# EasyEDA Pro project MP2236.eprj

# Schematic Schematic1
Create Date: 2023-08-06; Page Name: P1; Project Name: MP2236; Schematic Name: Schematic1; Update Date: 2023-08-06; Company: 嘉立创EDA; Page Size: A4; Version: V1.0
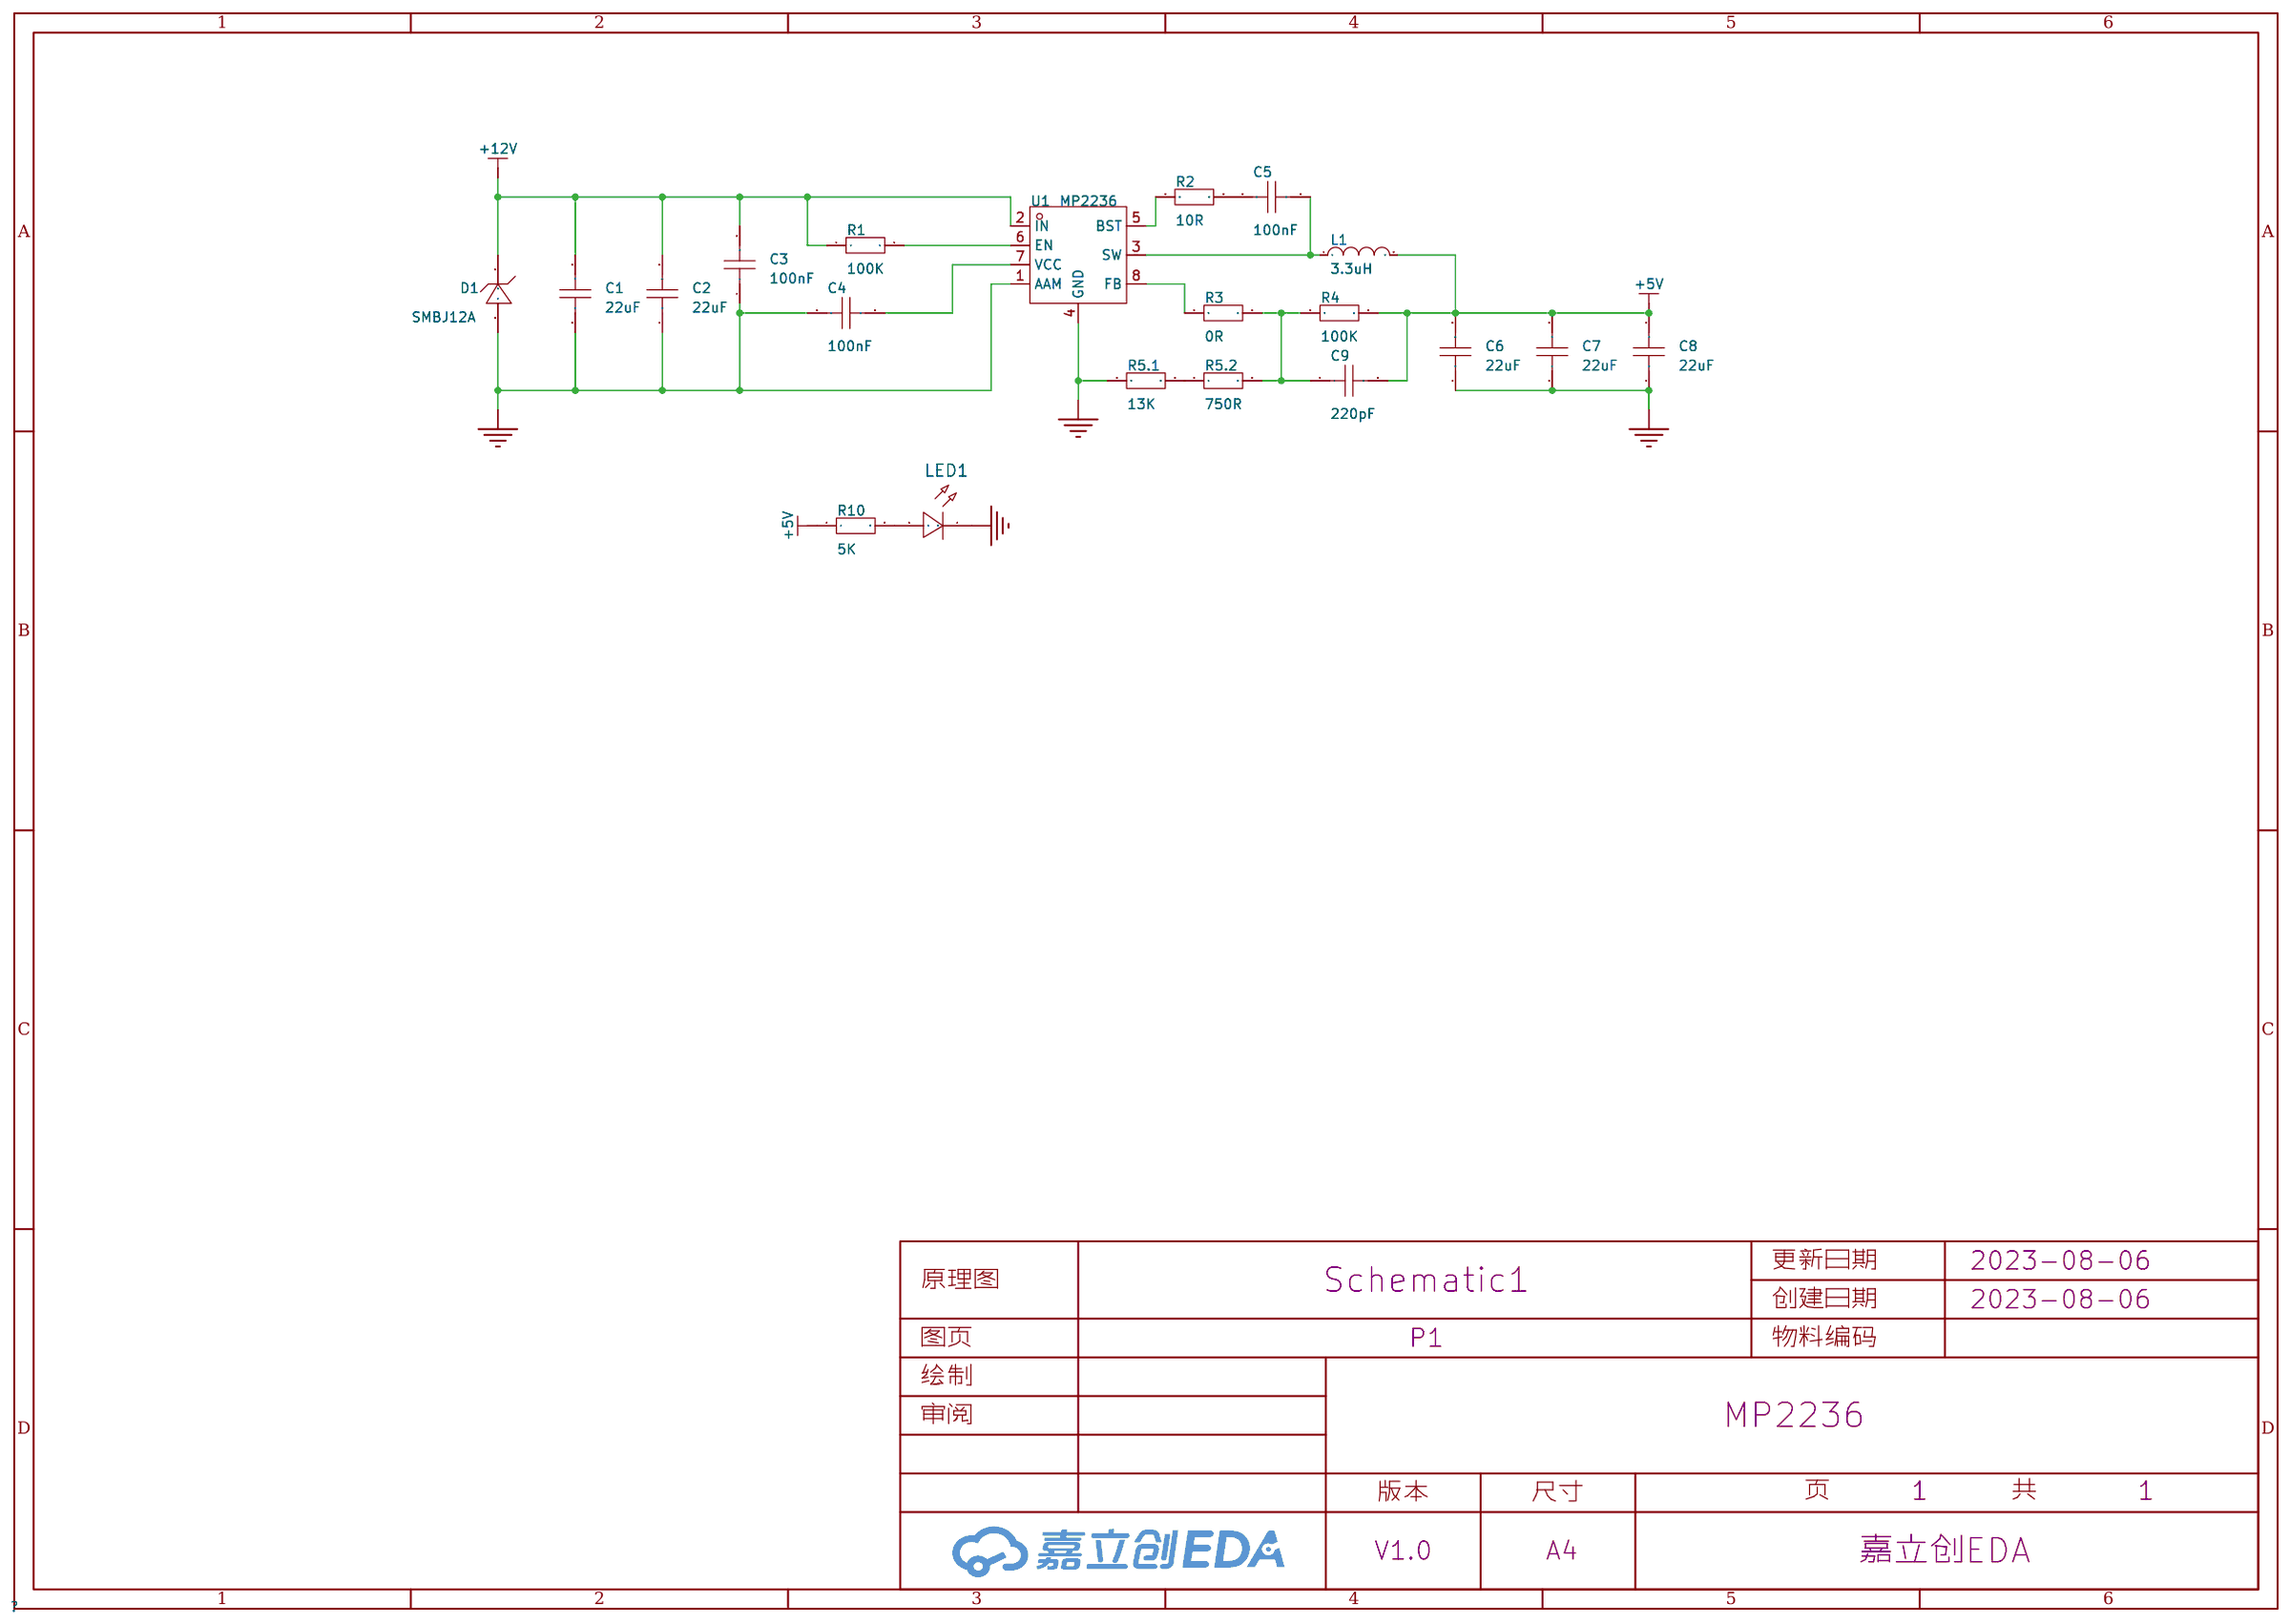
[diagram p0: schematic sheet]

## Parts
C1  22uF  [C1206]
C2  22uF  [C1206]
C3  100nF  [C0805]
C4  100nF  [C0603]
C5  100nF  [C0603]
C6  22uF  [C0805]
C7  22uF  [C0805]
C8  22uF  [C0805]
C9  220pF  [C0603]
D1  SMBJ12A  [SMB_L4.6-W3.6-LS5.3-RD]
L1  3.3uH  [IND-SMD_L7.3-W6.6]
LED1  -  [LED_0603]
R1  100K  [R0603]
R2  10R  [R0603]
R3  0R  [R0603]
R4  100K  [R0603]
R5.1  13K  [R0603]
R5.2  750R  [R0603]
R10  5K  [R0603]
U1  MP2236  [TSOT-23-8_L2.9-W1.6-P0.65-LS2.8-BL]

## Library data of the parts
C1 C2 = CAP_1206: Supplier Footprint: 1206
C3 C6-C8 = CAP_0805: Supplier Footprint: 0805
C4 C5 C9 = CAP_0603: Supplier Footprint: 0603
D1 = SMBJ12A_C127552: 极性:Unidirectional;峰值脉冲电流（10/1000us）:30.2A;箝位电压:19.9V;击穿电压（最小值）:13.3V;反向关断电压（典型值）:12V;; Supplier Part: C127552; Supplier Footprint: SMB(DO-214AA); JLCPCB Part Class: Extended Part; Datasheet: https://atta.szlcsc.com/upload/public/pdf/source/20170919/C127552_1505799641526977487.pdf; Supplier: LCSC
L1 = MCS0630-2R2MPY1: 电感值:2.2uH;精度:±20%;额定电流:8A;饱和电流(Isat):12A;; LCSC Part Name: 2.2uH ±20% 8A 17mΩ; Supplier Part: C2937096; Manufacturer: PSA(信昌电陶); Supplier Footprint: 0630; JLCPCB Part Class: Extended Part; Datasheet: https://atta.szlcsc.com/upload/public/pdf/source/20220121/EA6E6E6F70ED7BAE67EC293805EAAACB.pdf; Supplier: LCSC; Tolerance: ±20%; Rated Current: 8A; Saturation Current (Isat): 12A; DC Resistance (DCR): 17mΩ
LED1 = LED_0603-R: Supplier Footprint: 0603
R1-R4 R5.1 R5.2 R10 = Res_0603: Supplier Footprint: 0603
U1 = MP2315SGJ-Z: Supplier Part: C3031493; Supplier Footprint: TSOT23-8; JLCPCB Part Class: Extended Part; Datasheet: https://atta.szlcsc.comnull; Supplier: LCSC

## Nets
+5V: C6.2 C7.2 C8.2 C9.2 L1.2 R4.2 R10.1
+12V: C1.2 C2.2 C3.2 D1.1(C) R1.1 U1.2(IN)
GND: C1.1 C2.1 C3.1 C4.1 C6.1 C7.1 C8.1 D1.2(A) LED1.1(C) R5.1.1 U1.1(AAM) U1.4(GND)
$1N587: R1.2 U1.6(EN)
$1N589: C4.2 U1.7(VCC)
$1N604: R2.1 U1.5(BST)
$1N607: C5.2 L1.1 U1.3(SW)
$1N1046: R5.1.2 R5.2.1
$1N1855: R3.1 U1.8(FB)
$1N1858: C9.1 R3.2 R4.1 R5.2.2
$1N2066: C5.1 R2.2
$1N2285: LED1.2(A) R10.2

# Board PCB1
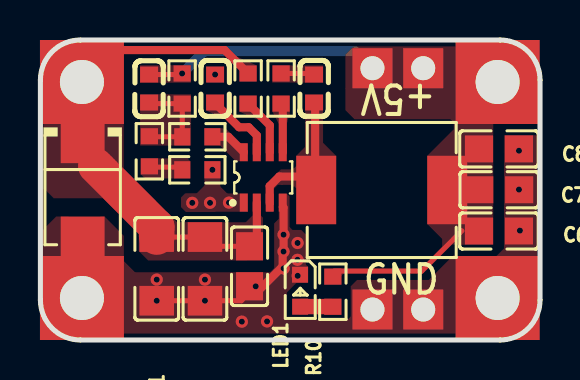
[diagram p1: board, top side]
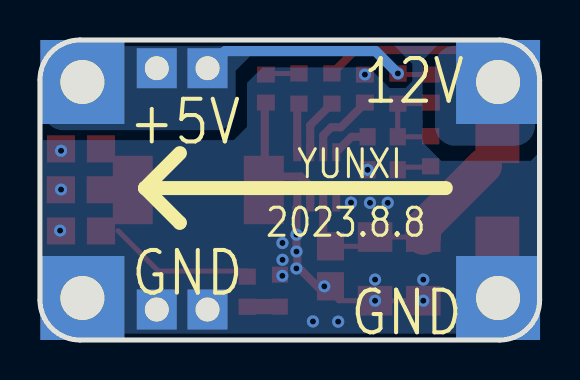
[diagram p2: board, bottom side, seen from below]

Outline 25 x 15 mm; copper layers: Top Layer, Bottom Layer. Coordinates in mm from the lower left corner of the outline.
Outline path: 0,13 0,2 arc(0.59,0.59) 2,0 23,0 arc(24.41,0.59) 25,2 25,13 arc(24.41,14.41) 23,15 2,15 arc(0.59,14.41) 0,13
Stack: Top Layer 0.035mm / Dielectric1 1.51mm FR4 er 4.5 / Bottom Layer 0.035mm

## Design rules (mm)
template: JLCPCB Capability(Two Layers Board)
spacing copperThickness1oz (default): track to track 0.102, other pairs 0.152 to 0.3
spacing copperThickness2oz: track to track 0.203, other pairs 0.152 to 0.3
track width copperThickness1oz (default): min 0.127, default 0.254, max 2.54
track width copperThickness2oz: min 0.203, default 0.254, max 2.54
differential pair differentialPair (default): width min 0.127, default 0.254, max 2.54; gap min 0.152, default 0.152
via viaSize (default): diameter min 0.5, default 0.61, max 10; hole min 0.3, default 0.305, max 6.3

## Placement (name value [footprint] x y rotation side)
C1  22uF  [C1206]  5.82 3.56 90 top
C2  22uF  [C1206]  8.23 3.56 90 top
C3  100nF  [C0805]  10.46 3.69 90 top
C4  100nF  [C0603]  8.74 12.57 270 top
C5  100nF  [C0603]  13.69 12.57 270 top
C6  22uF  [C0805]  22.95 5.45 180 top
C7  22uF  [C0805]  22.96 7.51 180 top
C8  22uF  [C0805]  22.95 9.55 180 top
C9  220pF  [C0603]  5.44 12.57 90 top
D1  SMBJ12A  [SMB_L4.6-W3.6-LS5.3-RD]  2.11 7.51 270 top
L1  3.3uH  [ind-smd_l7.3-w6.6]  17.08 7.5 180 top
LED1  -  [LED_0603]  13 2.42 270 top
NOREF  -  [Pad_e123]  16.62 13.59 0 top
NOREF#2  -  [Pad_e105]  2.08 12.9 0 top
NOREF#3  -  [Pad_e107]  22.88 2.1 0 top
NOREF#4  -  [Pad_e124]  19.16 13.59 0 top
NOREF#5  -  [Pad_e127]  19.16 1.52 0 top
NOREF#6  -  [Pad_e126]  16.62 1.52 0 top
NOREF#7  -  [Pad_e103]  2.08 2.1 0 top
NOREF#8  -  [Pad_e106]  22.88 12.9 0 top
R1  100K  [R0603]  10.39 12.57 270 top
R2  10R  [R0603]  12.04 12.57 90 top
R3  0R  [R0603]  7.85 10.16 180 top
R4  100K  [R0603]  7.09 12.57 90 top
R5.1  13K  [R0603]  7.85 8.51 180 top
R5.2  750R  [R0603]  5.45 9.44 90 top
R10  5K  [R0603]  14.63 2.42 270 top
U1  MP2236  [TSOT-23-8_L2.9-W1.6-P0.65-LS2.8-BL]  11.15 8.13 0 top

## Footprints (pads in the part's own frame, mm; a bottom-side part is the same pattern mirrored in y, then rotated)
C0603
  rect 0.8x0.9 smd: 1(-0.7,0) 2(0.7,0)
C0805
  rect 1.41x1.35 smd: 1(-1,0) 2(1,0)
C1206
  rect 1.485x1.728 smd: 1(-1.593,0) 2(1.593,0)
ind-smd_l7.3-w6.6
  rect 2x3.42 smd: 1(3.278,0) 2(-3.278,0)
LED_0603
  rect 0.8x0.8 smd: 1(-0.851,-0.01) 2(0.75,-0.005)
Pad_e103
  rect 4.2x4.2 hole 2.2: 1(0,0)
Pad_e105
  rect 4.2x4.2 hole 2.2: 1(0,0)
Pad_e106
  rect 4.2x4.2 hole 2.2: 2(0,0)
Pad_e107
  rect 4.2x4.2 hole 2.2: 3(0,0)
Pad_e123
  rect 2x2 hole 1.2: 1(0,0)
Pad_e124
  rect 2x2 hole 1.2: 1(0,0)
Pad_e126
  rect 2x2 hole 1.2: 1(0,0)
Pad_e127
  rect 2x2 hole 1.2: 1(0,0)
R0603
  rect 0.806x0.864 smd: 1(-0.753,0) 2(0.753,0)
SMB_L4.6-W3.6-LS5.3-RD
  rect 2.047x2.192 smd: 1(-2.361,0) 2(2.361,0)
TSOT-23-8_L2.9-W1.6-P0.65-LS2.8-BL
  rect 0.4x0.9 smd: 1(-0.975,-1.26) 2(-0.325,-1.26) 3(0.325,-1.26) 4(0.975,-1.26) 5(0.975,1.26) 6(0.325,1.26) 7(-0.325,1.26) 8(-0.975,1.26)

## Nets
+5V: C6.2 C7.2 C8.2 C9.2 L1.2 NOREF.1 NOREF#4.1 NOREF#8.2 R4.2 R10.1
+12V: C1.2 C2.2 C3.2 D1.1 NOREF#2.1 R1.1 U1.2
GND: C1.1 C2.1 C3.1 C4.1 C6.1 C7.1 C8.1 D1.2 LED1.1 NOREF#3.3 NOREF#5.1 NOREF#6.1 NOREF#7.1 R5.1.1 U1.1 U1.4
$1N587: R1.2 U1.6
$1N589: C4.2 U1.7
$1N604: R2.1 U1.5
$1N607: C5.2 L1.1 U1.3
$1N1046: R5.1.2 R5.2.1
$1N1855: R3.1 U1.8
$1N1858: C9.1 R3.2 R4.1 R5.2.2
$1N2066: C5.1 R2.2
$1N2285: LED1.2 R10.2

## Via types
v1: diameter 0.61, hole 0.305, Top Layer to Bottom Layer, 22 vias

## Routing (per net, layer and track width the routed paths; a pad name or vN(x,y) marks a point on that pad's centre or on a via; arc(x,y) is an arc through that point)
+5V: length 19.2
  Top Layer w0.254: C9.2 7.04,13.27 v1(7.09,13.33) ; 21.09,5.46 19.08,3.45 14.68,3.45
  Bottom Layer w0.508: v1(7.09,13.33) 8.21,14.45 15.72,14.45 16.56,13.61
+12V: length 21.9
  Top Layer w0.254: 10.77,4.68 8.7,4.68 C2.2 C1.2
  Top Layer w0.406: 10.83,6.87 10.83,4.74 10.77,4.68 ; R1.1 9.22,14.5 3.69,14.5 2.48,13.28 2.48,12.5
  Top Layer w1.778: C1.2 5.82,5.66 2.77,8.7
GND: length 10.4
  Top Layer w0.254: 10.95,2.51 v1(10.77,2.68) 10.05,1.96 v1(8.23,1.96) v1(5.82,1.96)
  Top Layer w0.406: 10.73,2.51 10.95,2.51 12.12,3.68 12.12,4.38 v1(12.17,4.42) v1(12.17,5.27) 12.17,6.61 12.13,6.65
  vias: v1(5.82,3.02) v1(7.6,6.86) v1(8.23,3.02) v1(8.49,6.86) v1(8.61,8.51) v1(8.74,13.27) v1(9.44,6.87) v1(10.08,0.92) v1(11.34,0.93) v1(12.17,3.58) v1(12.87,4.85) v1(12.86,4.01) v1(12.87,3.21) v1(23.95,9.46) v1(23.95,7.52) v1(23.99,5.47)
$1N587: length 2.9
  Top Layer w0.406: R1.2 11.48,10.73 11.48,9.39
$1N589: length 3.7
  Top Layer w0.406: 10.83,9.31 10.83,10.23 10.42,10.64 9.94,10.64 8.77,11.81 8.77,11.85
$1N604: length 2.5
  Top Layer w0.406: 12.13,9.39 12.13,11.73 R2.1
$1N607: length 6.4
  Top Layer w0.406: 13.28,8.17 11.95,8.17 11.47,7.7 11.47,6.84 ; 13.75,8.36 13.75,11.86 13.73,11.87
$1N1046: length 1.7
  Top Layer w0.254: R5.1.2 6.96,8.64 5.44,8.64
$1N1855: length 1.9
  Top Layer w0.406: 10.18,9.39 9.41,10.16 R3.1
$1N1858: length 5
  Top Layer w0.254: 5.44,10.15 5.45,10.16 R3.2 7.1,11.81 R4.1 5.49,11.82 C9.1
$1N2066: length 1.7
  Top Layer w0.254: R2.2 13.64,13.33 C5.1
$1N2285: length 1.5
  Top Layer w0.762: 13.02,1.67 14.56,1.67

## Copper pours and planes (outline as drawn; the poured copper is in the pictures)
+5V on Top Layer: 15.66,14.68 20.83,14.68 20.83,11.98 15.66,11.98
+5V on Top Layer: 15.26,14.68 15.78,14.68 15.78,12.19 15.26,12.19
+5V on Top Layer: 19.36,10.73 21.52,10.73 21.52,8.69 19.36,8.69
+5V on Top Layer: 19.36,6.26 21.33,6.26 21.33,4.77 19.36,4.77
+5V on Top Layer: 4.98,13.74 7.53,13.74 7.53,12.86 4.98,12.86
+5V on Top Layer: 21.07,10.77 22.66,10.77 22.66,4.77 21.07,4.77
+5V on Top Layer: 15.26,12.62 21.35,12.62 21.35,11.04 15.26,11.04
+5V on Bottom Layer: 15.21,14.69 16.29,14.69 16.29,13.63 15.21,13.63
+5V on Bottom Layer: 14.29,14.4 15.84,14.4 15.84,13.36 14.29,13.36
+5V on Bottom Layer: 15.21,14.69 24.83,14.69 24.83,10.49 15.21,10.49
+12V on Top Layer: 4.96,5.13 10.44,5.13 10.44,3.98 4.96,3.98
+12V on Top Layer: 6.42,5.89 9.1,5.89 9.1,4.41 6.42,4.41
+12V on Top Layer: 0.25,9.15 3.56,9.15 3.56,7.09 0.25,7.09
+12V on Top Layer: 5.98,6.41 7.04,6.41 7.04,5.18 5.98,5.18
+12V on Top Layer: 9.1,5.89 10.72,5.89 10.72,5.08 9.1,5.08
+12V on Top Layer: 0.15,10.89 4.17,10.89 4.17,8.54 0.15,8.54
+12V on Bottom Layer: 0.23,14.71 5.23,14.71 5.23,9.71 0.23,9.71
GND on Top Layer: 12.26,5.8 13.28,5.8 13.28,3.75 12.26,3.75
GND on Top Layer: 15.52,3 18.09,3 18.09,0.61 15.52,0.61
GND on Top Layer: 7.27,7.33 10.38,7.33 10.38,6.41 7.27,6.41
GND on Top Layer: 23.2,6.71 24.71,6.71 24.71,4.19 23.2,4.19
GND on Top Layer: 15.89,3 22.48,3 22.48,0.71 15.89,0.71
GND on Top Layer: 19.4,4.25 20.92,4.25 20.92,2.88 19.4,2.88
GND on Top Layer: 4.02,1.02 20.86,1.02 20.86,0.32 4.02,0.32
GND on Top Layer: 0.24,6.17 1.88,6.17 1.88,4.16 0.24,4.16
GND on Top Layer: 7.04,7.86 9.5,7.86 9.5,6.41 7.04,6.41
GND on Top Layer: 24.68,10.24 24.86,10.24 24.86,4.19 24.68,4.19
GND on Top Layer: 11.01,3.94 12.21,3.94 12.21,2.89 11.01,2.89
GND on Top Layer: 23.2,10.24 24.71,10.24 24.71,9.36 23.2,9.36
GND on Top Layer: 3.76,3.39 11.96,3.39 11.96,0.39 3.76,0.39
GND on Top Layer: 11.89,4.01 12.33,4.01 12.33,0.32 11.89,0.32
GND on Top Layer: 12.28,4.36 13.39,4.36 13.39,2.84 12.28,2.84
GND on Top Layer: 11.7,6.32 12.2,6.32 12.2,3.54 11.7,3.54
GND on Top Layer: 2.92,6.18 4.17,6.18 4.17,4.14 2.92,4.14
GND on Top Layer: 23.2,9.39 24.71,9.39 24.71,6.71 23.2,6.71
GND on Bottom Layer: 5.83,10 24.86,10 24.86,0.32 5.83,0.32
GND on Bottom Layer: 0.13,8.84 5.93,8.84 5.93,0.32 0.13,0.32
GND on Bottom Layer: 8.42,12.86 14.65,12.86 14.65,9.35 8.42,9.35
GND on Bottom Layer: 0.12,9.27 5.41,9.27 5.41,8.21 0.12,8.21
GND on Bottom Layer: 6.29,12.6 7.79,12.6 7.79,11.81 6.29,11.81
GND on Bottom Layer: 5.86,13.41 7.93,13.41 7.93,10.8 5.86,10.8
GND on Bottom Layer: 5.85,13.63 14.64,13.63 14.64,9.06 5.85,9.06
GND on Bottom Layer: 4.84,9.63 6.43,9.63 6.43,8.14 4.84,8.14
GND on Bottom Layer: 13.59,10.92 15.96,10.92 15.96,9.34 13.59,9.34
GND on Bottom Layer: 5.14,14.71 7.27,14.71 7.27,12.62 5.14,12.62
GND on Bottom Layer: 4.39,9.91 6.52,9.91 6.52,8.38 4.39,8.38
$1N607 on Top Layer: 13.25,11.48 14.14,11.48 14.14,9.15 13.25,9.15
$1N1855 on Top Layer: 8.98,10 10.21,10 10.21,8.94 8.98,8.94
$1N1858 on Top Layer: 4.99,12.29 7.54,12.29 7.54,9.72 4.99,9.72
$1N2066 on Top Layer: 11.61,13.73 14.15,13.73 14.15,12.87 11.61,12.87

Small or netless copper shapes (teardrops, artwork), in the pictures only: 60 on Top Layer

## Text on the board
Bottom Silkscreen Layer: YUNXI | 2023.8.8 | GND | 12V | +5V
Top Silkscreen Layer: GND | +5V
